# EAGLE schematic final_control (EAGLE 8.2.2)
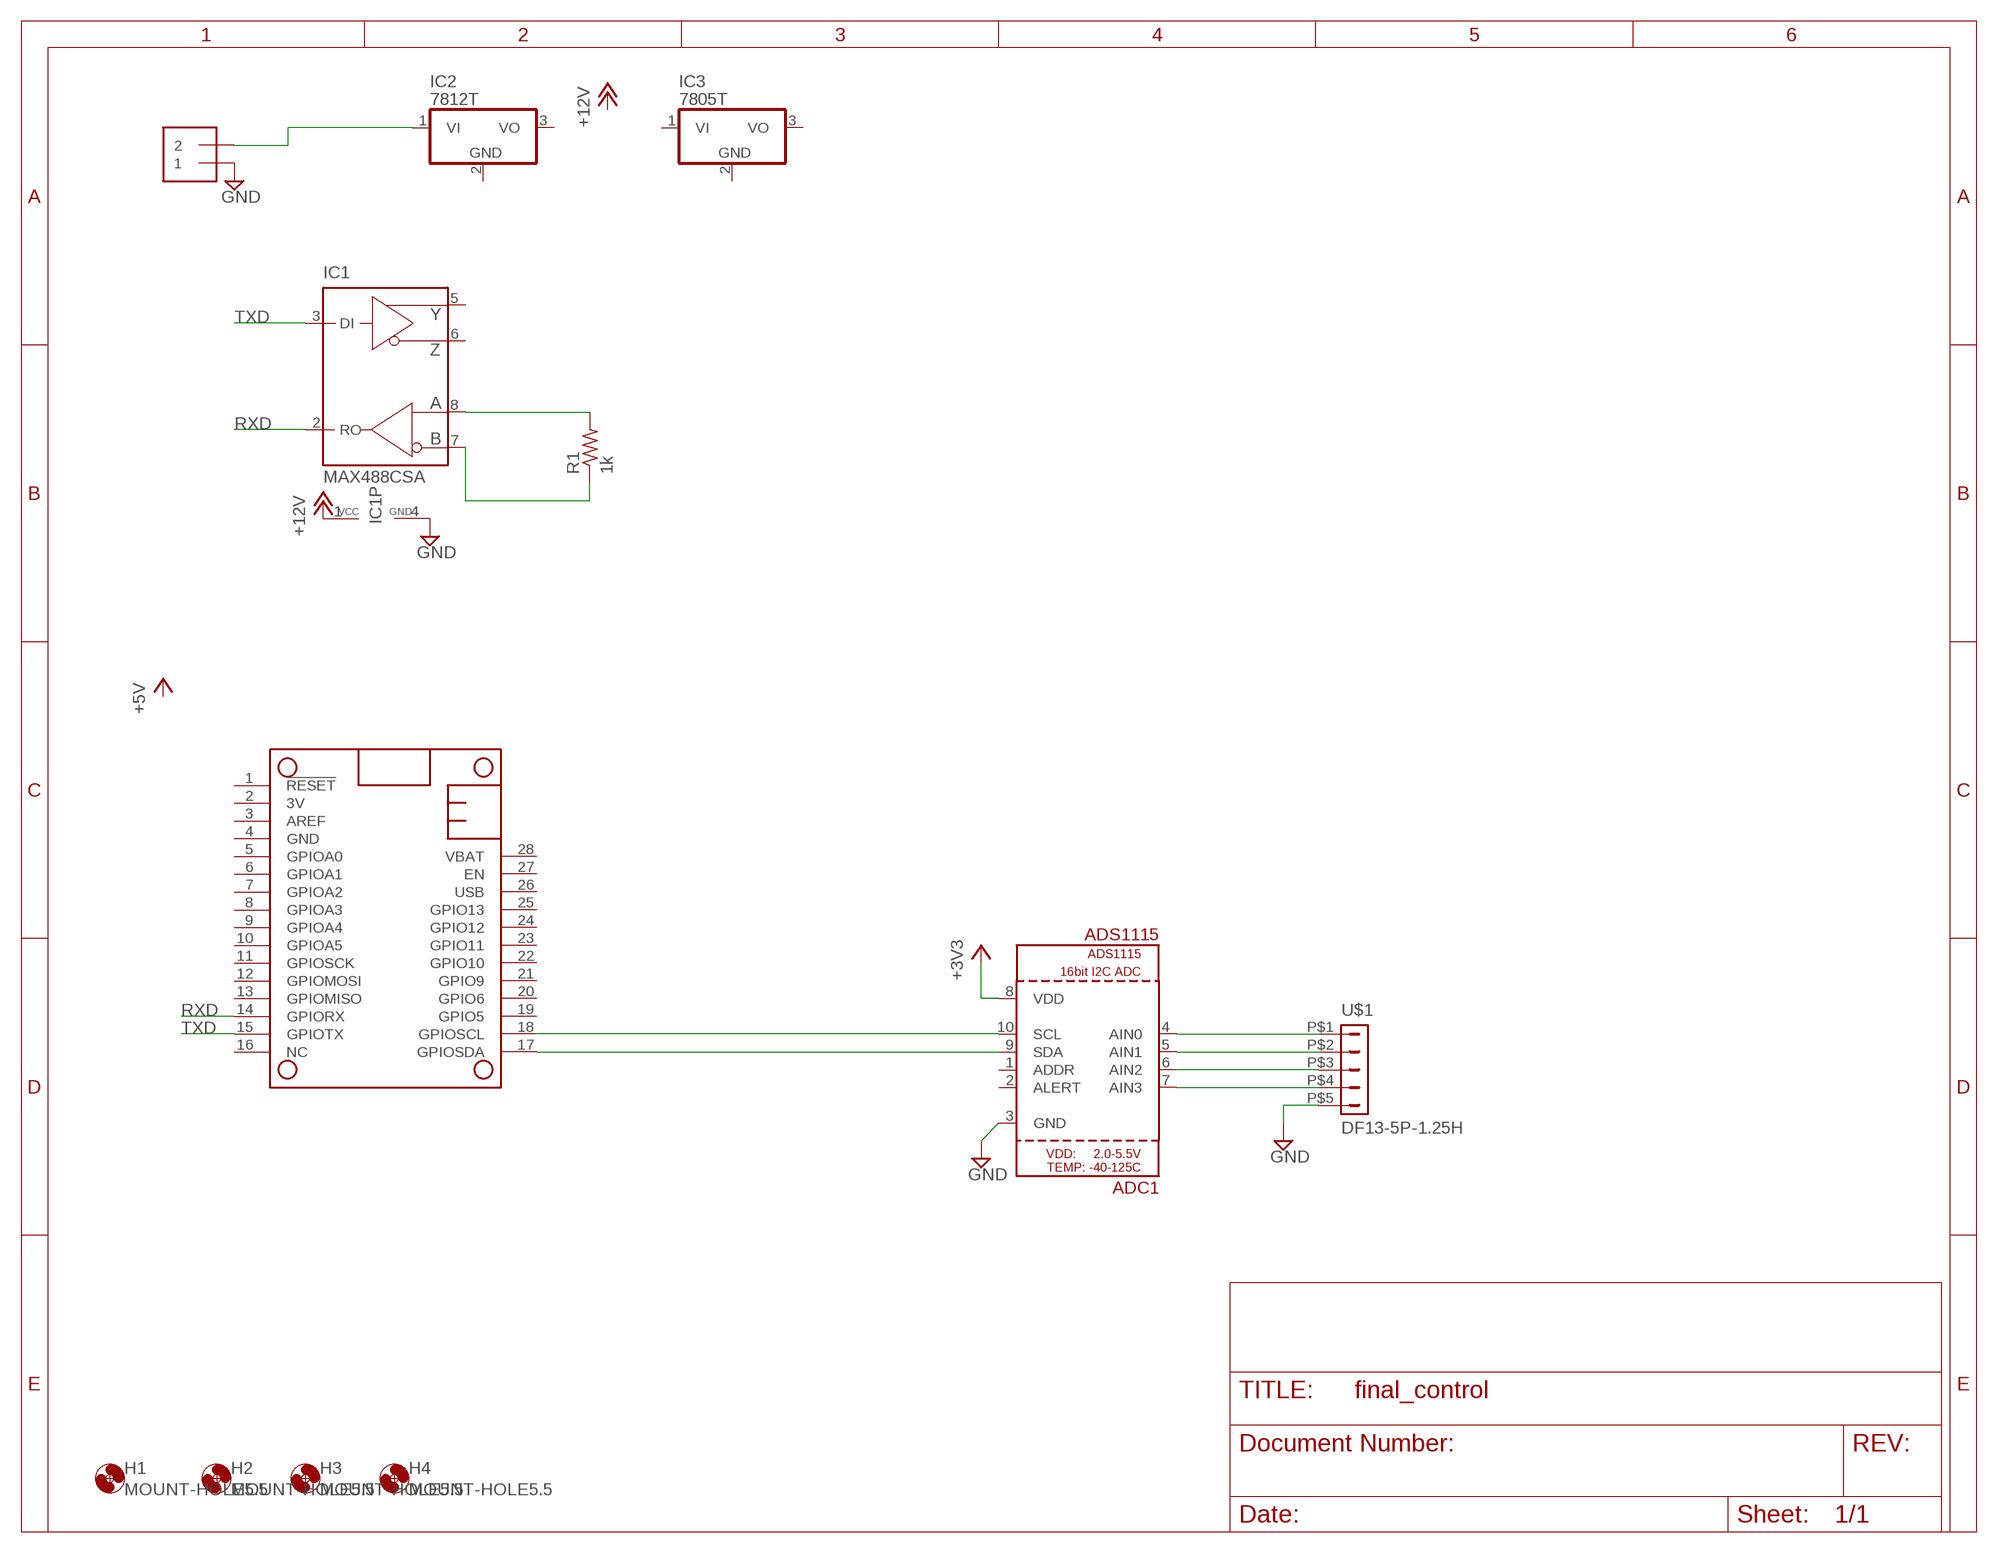
[diagram p0: schematic, sheet 1]

## Parts
ADC1  ADS1115  [MSOP10]
FEATHER_32U4  FEATHERWING_NODIM  [FEATHERWING_DIM]
H1  MOUNT-HOLE5.5  [5,5]
H2  MOUNT-HOLE5.5  [5,5]
H3  MOUNT-HOLE5.5  [5,5]
H4  MOUNT-HOLE5.5  [5,5]
IC1  MAX488CSA  [SO08]
IC2  7812T  [TO220H]
IC3  7805T  [TO220H]
J1  1X2-3.5MM  [1X2-3.5MM]
R1  1k  R-US_R0805  [R0805]
U$1  DF13-5P-1.25H  [DF13A-5P-1.25H]

## Nets
+3V3: ADC1.8(VDD)
+12V: IC1.1(VCC)
GND: ADC1.3(GND) IC1.4(GND) J1.1 U$1.P$5
N$1: IC1.8(A) R1.2
N$2: IC1.7(B) R1.1
N$3: ADC1.10(SCL) FEATHER_32U4.18(GPIOSCL)
N$4: ADC1.9(SDA) FEATHER_32U4.17(GPIOSDA)
N$5: ADC1.4(AIN0) U$1.P$1
N$6: ADC1.5(AIN1) U$1.P$2
N$7: ADC1.6(AIN2) U$1.P$3
N$8: ADC1.7(AIN3) U$1.P$4
N$9: IC2.1(VI) J1.2
RXD: FEATHER_32U4.14(GPIORX) IC1.2(RO)
TXD: FEATHER_32U4.15(GPIOTX) IC1.3(DI)
Unconnected: ADC1.1(ADDR) ADC1.2(ALERT) FEATHER_32U4.1(!RESET) FEATHER_32U4.2(3V) FEATHER_32U4.3(AREF) FEATHER_32U4.5(GPIOA0) FEATHER_32U4.6(GPIOA1) FEATHER_32U4.7(GPIOA2) FEATHER_32U4.8(GPIOA3) FEATHER_32U4.9(GPIOA4) FEATHER_32U4.10(GPIOA5) FEATHER_32U4.11(GPIOSCK) FEATHER_32U4.12(GPIOMOSI) FEATHER_32U4.13(GPIOMISO) FEATHER_32U4.16(NC) FEATHER_32U4.19(GPIO5) FEATHER_32U4.20(GPIO6) FEATHER_32U4.21(GPIO9) FEATHER_32U4.22(GPIO10) FEATHER_32U4.23(GPIO11) FEATHER_32U4.24(GPIO12) FEATHER_32U4.25(GPIO13) FEATHER_32U4.26(USB) FEATHER_32U4.27(EN) FEATHER_32U4.28(VBAT) IC1.5(Y) IC1.6(Z) IC2.2(GND) IC2.3(VO) IC3.1(VI) IC3.2(GND) IC3.3(VO)

## Power pins joined to a net without a drawn wire
GND: FEATHER_32U4.4(GND)

## Library data of the parts
ADC1 = vtgs:ADS1115
FEATHER_32U4 = adafruit:FEATHERWING
H1-H4 = holes:MOUNT-HOLE: MOUNTING HOLE with drill center marker
IC1 = maxim:MAX488: RS485 TRANSEIVER Source: Data sheet <http://datasheets.maxim-ic.com/en/ds/MAX1487-MAX491.pdf>; MF: MAXIM; MPN: MAX488CSA; OC_FARNELL: 3534170; OC_NEWARK: 34C3921
IC2 IC3 = adafruit:78*: Positive VOLTAGE REGULATOR Added bigger pads to the TO-92 package
J1 = adafruit:1X2: 3.5mm Terminal block http://www.ladyada.net/library/pcb/eaglelibrary.html
R1 = resistor:R-US_: RESISTOR, American symbol
U$1 = con-hirose-df13:DF13-5P-1.25: DF13-5P 1.25mm Pitch Miniature Crimping Connector.